# EAGLE board Gibbot v4.2 (EAGLE 5.12), part 1 of 3
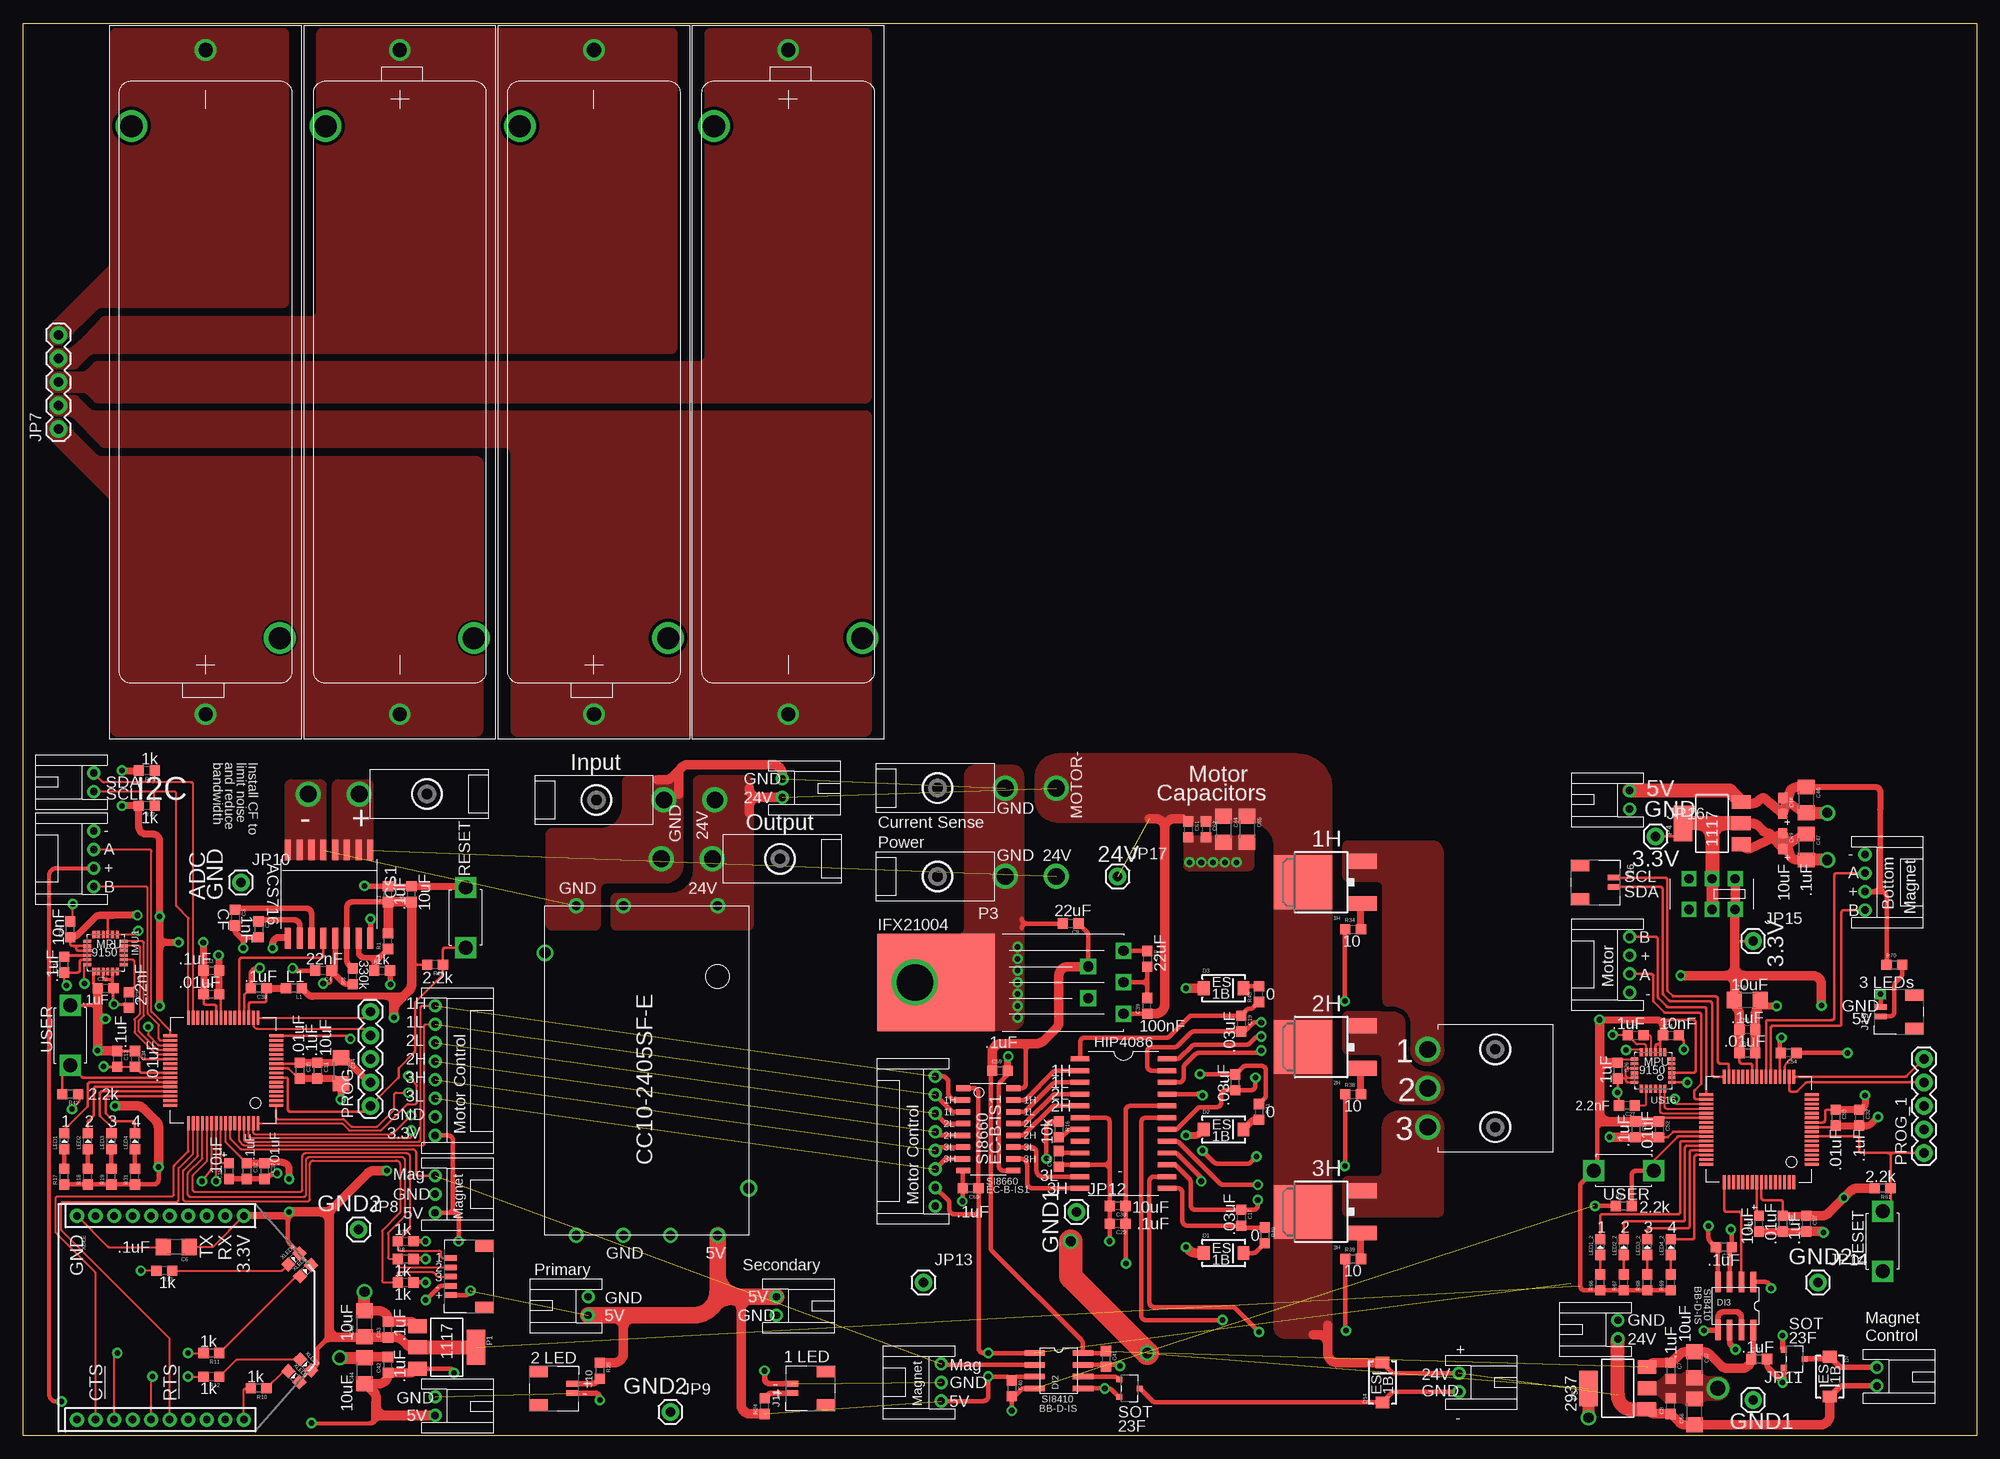
[diagram p7: board, top side]
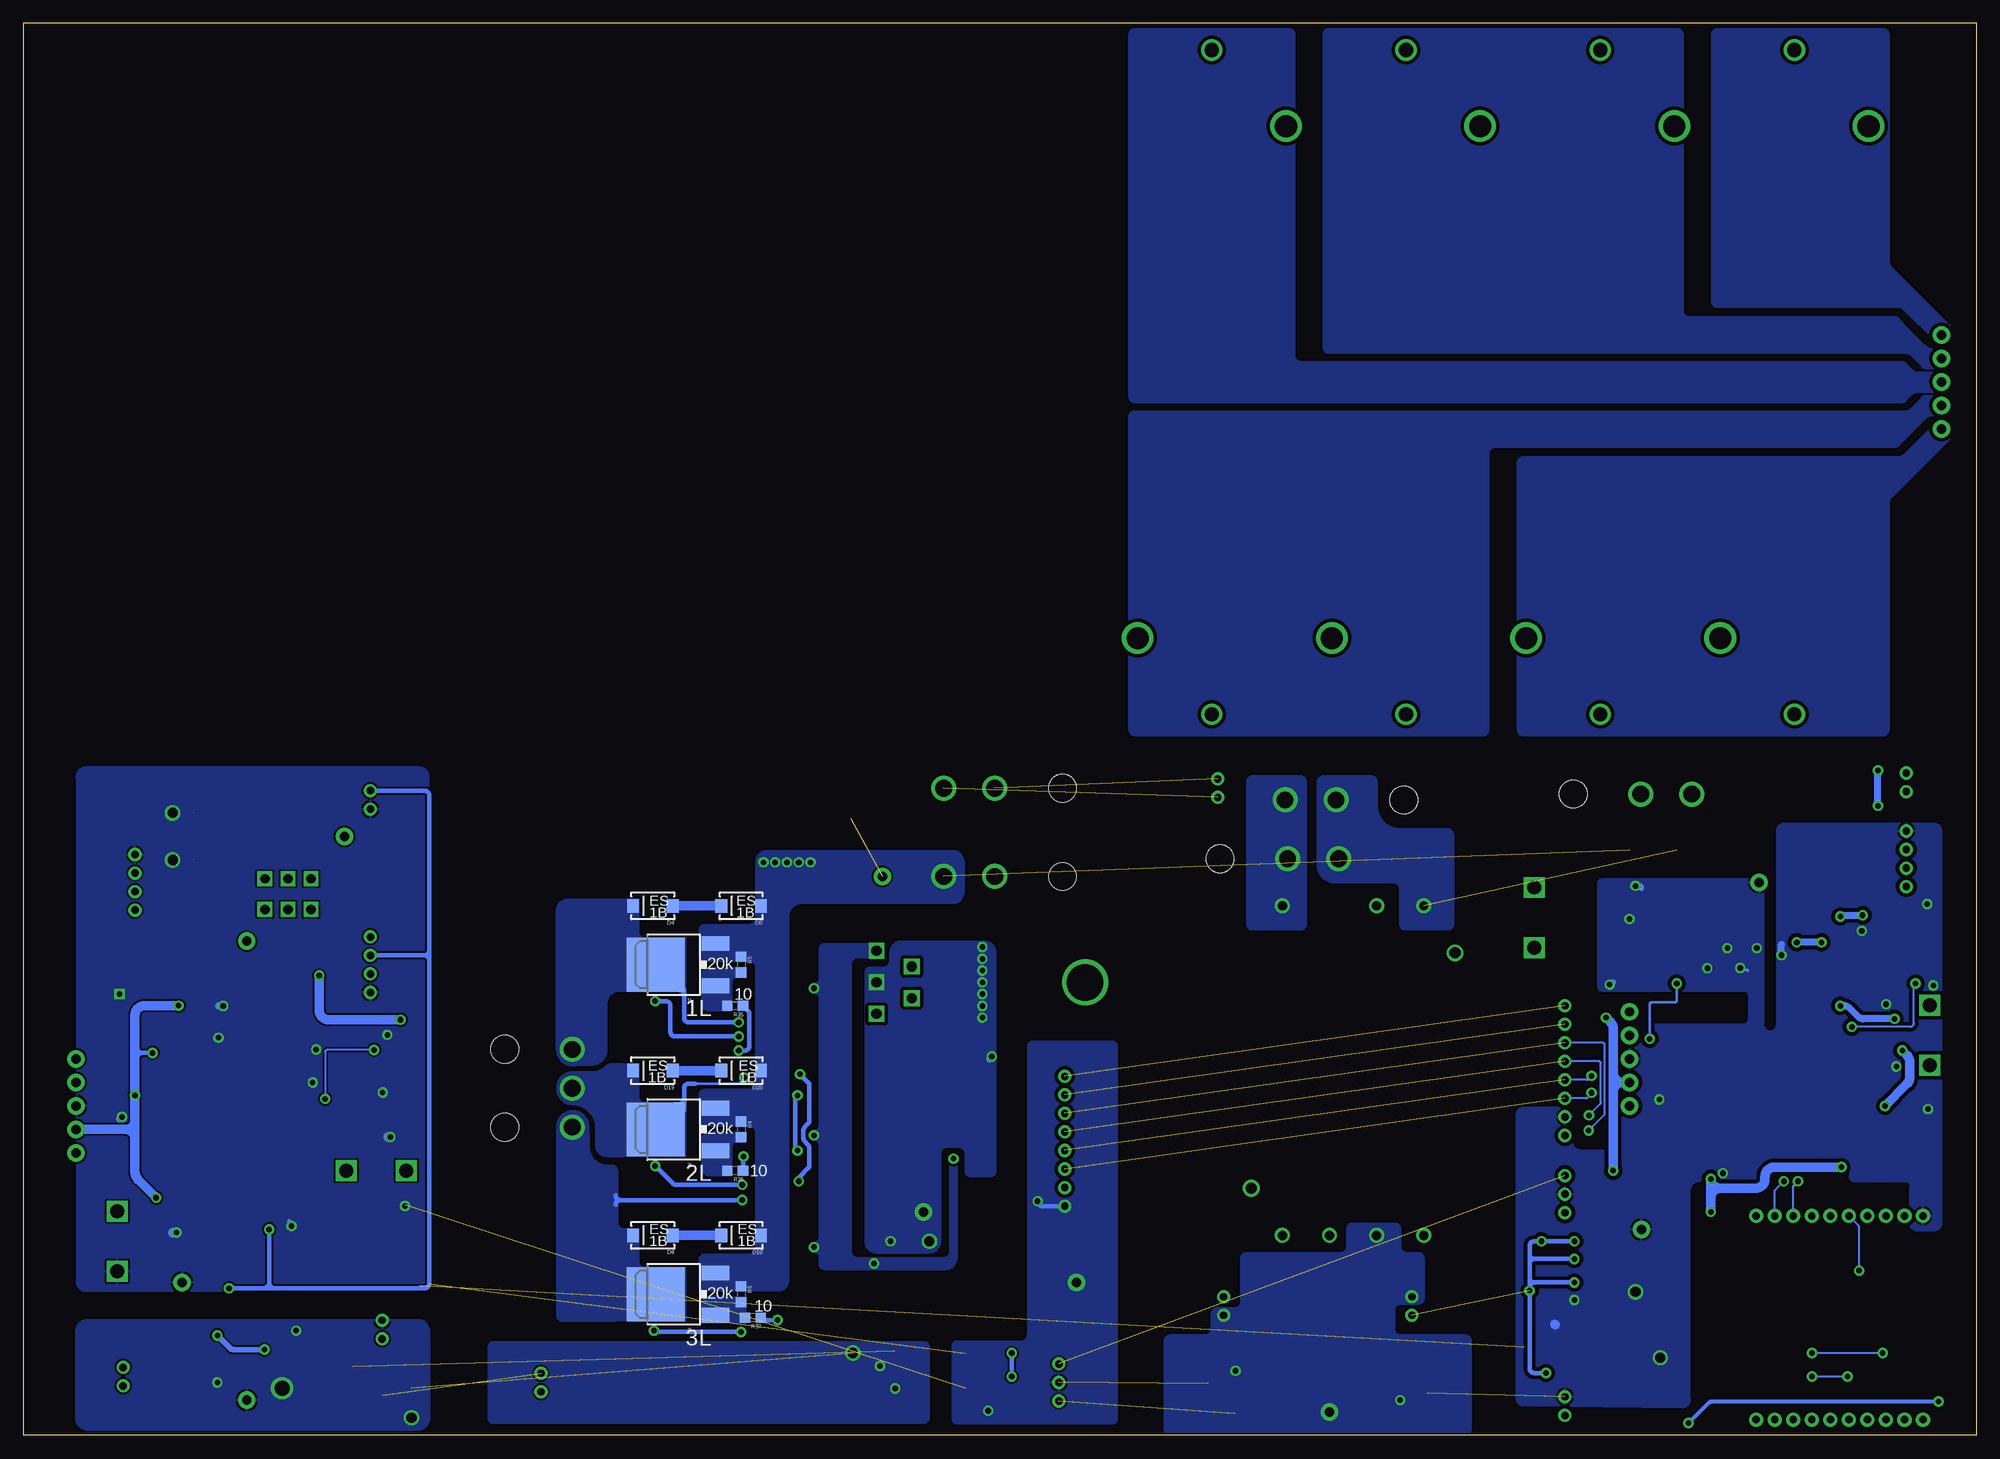
[diagram p8: board, bottom side, seen from below]

Size 210.82 x 152.4 mm. Coordinates in mm from the lower left corner, seen from the top.
Outline: 0,0 210.82,0 210.82,152.4 0,152.4 0,0
Copper layers (1*16): Top 0.035mm / dielectric 1.5mm / Bottom 0.035mm
Design rules "Andrew *": minimum track width 8mil, minimum drill 20mil, track to track 8mil, track to pad 8mil, pad to pad 2mil, via to via 8mil, smd to smd 8mil, copper to edge 10mil, drill to drill 8mil, minimum pad ring 12mil, minimum via ring 10mil, stop-mask expansion 4mil, vias tented up to drill 25mil, thermal gap 10mil

## Footprints (pad centres in the part's own frame; a part is rotated, then mirrored left to right if it is on the bottom)
DPAK = smd 5.791 x 6.274: D 0,1.587 | smd 1.6 x 3: G -2.286,-4.851; S 2.286,-4.851
1043P = drill 1.524 round: + -35.839,0; - 35.839,0 | drill 2.388 round: P$1 -27.622,-8.001; P$2 27.622,8.001
0603 = smd 1.1 x 1.1: 1 -0.85,0; 2 0.85,0
1206 = smd 1.6 x 1.8: 1 -1.4,0; 2 1.4,0
0603-POL = smd 1.1 x 1: + 0.85,0; - -0.85,0
SOIC16-W = smd 0.65 x 2.25: 1 -4.445,-4.75; 2 -3.175,-4.75; 3 -1.905,-4.75; 4 -0.635,-4.75; 5 0.635,-4.75; 6 1.905,-4.75; 7 3.175,-4.75; 8 4.445,-4.75; 9 4.445,4.75; 10 3.175,4.75; 11 1.905,4.75; 12 0.635,4.75; 13 -0.635,4.75; 14 -1.905,4.75; 15 -3.175,4.75; 16 -4.445,4.75
SMA-DIODE@1 = smd 1.27 x 1.47: A -2.15,0; C 2.15,0
SOIC16-N = smd 0.6 x 1.55: 1 -4.445,-2.7; 2 -3.175,-2.7; 3 -1.905,-2.7; 4 -0.635,-2.7; 5 0.635,-2.7; 6 1.905,-2.7; 7 3.175,-2.7; 8 4.445,-2.7; 9 4.445,2.7; 10 3.175,2.7; 11 1.905,2.7; 12 0.635,2.7; 13 -0.635,2.7; 14 -1.905,2.7; 15 -3.175,2.7; 16 -4.445,2.7
SOIC8-N = smd 2.2 x 0.6: 1 -2.6,1.905; 2 -2.6,0.635; 3 -2.6,-0.635; 4 -2.6,-1.905; 5 2.6,-1.905; 6 2.6,-0.635; 7 2.6,0.635; 8 2.6,1.905
LGA24_4X4 = smd 0.8 x 0.35: 1 -2,1.25; 2 -2,0.75; 3 -2,0.25; 4 -2,-0.25; 5 -2,-0.75; 6 -2,-1.25; 13 2,-1.25; 14 2,-0.75; 15 2,-0.25; 16 2,0.25; 17 2,0.75; 18 2,1.25 | smd 0.35 x 0.85: 7 -1.25,-1.975; 8 -0.75,-1.975; 9 -0.25,-1.975; 10 0.25,-1.975; 11 0.75,-1.975; 12 1.25,-1.975; 19 1.25,1.975; 20 0.75,1.975; 21 0.25,1.975; 22 -0.25,1.975; 23 -0.75,1.975; 24 -1.25,1.975
JST-2-PH-TH = drill 0.8 round: 1 -1,-6.35; 2 1,-6.35
JST-4-PH-TH = drill 0.8 round: 1 -3,-6.35; 2 -1,-6.35; 3 1,-6.35; 4 3,-6.35
JST-8-PH-TH = drill 0.8 round: 1 -7,-6.35; 2 -5,-6.35; 3 -3,-6.35; 4 -1,-6.35; 5 1,-6.35; 6 3,-6.35; 7 5,-6.35; 8 7,-6.35
JST-3-PH-TH = drill 0.8 round: 1 -2,-6.35; 2 0,-6.35; 3 2,-6.35
JST-SH-5 = smd 0.6 x 1.35: 1 2,4.675; 2 1,4.675; 3 0,4.675; 4 -1,4.675; 5 -2,4.675 | smd 1.2 x 2: P$6 -3.3,1; P$7 3.3,1
JST-SH-2 = smd 0.6 x 1.35: 1 0.5,4.675; 2 -0.5,4.675 | smd 1.2 x 2: P$6 -1.8,1; P$7 1.8,1
MOLEX-2-MINIFITJR-RA = drill 1.803 round: 1 0,13.894; 2 0,19.406 | hole 3: 0,6.604
MOLEX-3-MINIFITJR-RA = drill 1.803 round: 1 4.191,13.538; 2 0,13.538; 3 -4.191,13.538 | hole 3: -4.204,6.248; 4.204,6.248
1X05 = drill 1.016 pad 1.88 round: 1 0,0; 2 2.54,0; 3 5.08,0; 4 7.62,0; 5 10.16,0
1X01 = drill 1.016 pad 1.88 round: 1 0,0
0603-DIODE = smd 1.1 x 1.1: AN -0.85,0; CAT 0.85,0
SOT23F = smd 0.6 x 0.65: D 0,1.125; G -0.95,-1.125; S 0.95,-1.125
SOIC24-W = smd 0.533 x 1.981: 1 -6.985,-4.686; 2 -5.715,-4.686; 3 -4.445,-4.686; 4 -3.175,-4.686; 5 -1.905,-4.686; 6 -0.635,-4.686; 7 0.635,-4.686; 8 1.905,-4.686; 9 3.175,-4.686; 10 4.445,-4.686; 11 5.715,-4.686; 12 6.985,-4.686; 13 6.985,4.686; 14 5.715,4.686; 15 4.445,4.686; 16 3.175,4.686; 17 1.905,4.686; 18 0.635,4.686; 19 -0.635,4.686; 20 -1.905,4.686; 21 -3.175,4.686; 22 -4.445,4.686; 23 -5.715,4.686; 24 -6.985,4.686
SOT223 = smd 1.499 x 2.007: 1 -2.261,-3.15; 2 0.025,-3.15; 3 2.311,-3.15 | smd 3.81 x 2.007: 4 0,3.15
CC10-2405SF-E = drill 1 round: 1 -17.78,7.62; 2 -17.78,-2.54; 3 -17.78,-7.62; 4 17.78,-7.62; 5 17.78,-2.54; 6 17.78,2.54; 7 17.78,7.62 | drill 1.2 round: P$1 12.7,11; P$2 -12.7,-11
TO220-5 = drill 1.1 square: 1 3.81,-3.404; 2 0,-1.702; 3 3.81,0; 4 0,1.702; 5 3.81,3.404 | smd 12.7 x 10.541: PAD -16.434,0 | drill 3.937 round: PAD2 -18.72,0
TQFP64_10X10 = smd 1.5 x 0.3: 1 -5.7,3.75; 2 -5.7,3.25; 3 -5.7,2.75; 4 -5.7,2.25; 5 -5.7,1.75; 6 -5.7,1.25; 7 -5.7,0.75; 8 -5.7,0.25; 9 -5.7,-0.25; 10 -5.7,-0.75; 11 -5.7,-1.25; 12 -5.7,-1.75; 13 -5.7,-2.25; 14 -5.7,-2.75; 15 -5.7,-3.25; 16 -5.7,-3.75; 33 5.7,-3.75; 34 5.7,-3.25; 35 5.7,-2.75; 36 5.7,-2.25; 37 5.7,-1.75; 38 5.7,-1.25; 39 5.7,-0.75; 40 5.7,-0.25; 41 5.7,0.25; 42 5.7,0.75; 43 5.7,1.25; 44 5.7,1.75; 45 5.7,2.25; 46 5.7,2.75; 47 5.7,3.25; 48 5.7,3.75 | smd 0.3 x 1.5: 17 -3.75,-5.7; 18 -3.25,-5.7; 19 -2.75,-5.7; 20 -2.25,-5.7; 21 -1.75,-5.7; 22 -1.25,-5.7; 23 -0.75,-5.7; 24 -0.25,-5.7; 25 0.25,-5.7; 26 0.75,-5.7; 27 1.25,-5.7; 28 1.75,-5.7; 29 2.25,-5.7; 30 2.75,-5.7; 31 3.25,-5.7; 32 3.75,-5.7; 49 3.75,5.7; 50 3.25,5.7; 51 2.75,5.7; 52 2.25,5.7; 53 1.75,5.7; 54 1.25,5.7; 55 0.75,5.7; 56 0.25,5.7; 57 -0.25,5.7; 58 -0.75,5.7; 59 -1.25,5.7; 60 -1.75,5.7; 61 -2.25,5.7; 62 -2.75,5.7; 63 -3.25,5.7; 64 -3.75,5.7
TACTILE_SWITCH = drill 1.5 square: 1 -3.25,0; 2 3.25,0
SLIDE_SWITCH = drill 1 square: 1 -2.489,1.651; 2 0,1.651; 3 2.489,1.651; 4 2.489,-1.651; 5 0,-1.651; 6 -2.489,-1.651
XBEE-SILK = drill 0.8 pad 1.524 round: 1 -11,20; 2 -11,18; 3 -11,16; 4 -11,14; 5 -11,12; 6 -11,10; 7 -11,8; 8 -11,6; 9 -11,4; 10 -11,2; 11 11,2; 12 11,4; 13 11,6; 14 11,8; 15 11,10; 16 11,12; 17 11,14; 18 11,16; 19 11,18; 20 11,20

## Placement (x,y rotation side)
1H  IRLR024  [DPAK]  139.7,59.69 90 top
1L  IRLR024  [DPAK]  140.97,50.8 90 bottom
2H  IRLR024  [DPAK]  139.7,41.91 90 top
2L  IRLR024  [DPAK]  140.97,33.02 90 bottom
3H  IRLR024  [DPAK]  139.7,24.13 90 top
3L  IRLR024  [DPAK]  140.97,15.24 90 bottom
BAT1  BATTERY-18650HOLDER  [1043P]  19.68,113.67 90 top
BAT2  BATTERY-18650HOLDER  [1043P]  40.64,113.67 270 top
BAT3  BATTERY-18650HOLDER  [1043P]  61.59,113.67 90 top
BAT4  BATTERY-18650HOLDER  [1043P]  82.55,113.67 270 top
C1  .1uF  [0603]  39.37,58.42 90 top
C2  1nF  [0603]  25.4,54.61 270 top
C3  DNI  [0603]  22.86,55.88 270 top
C4  22nF  [0603]  32.38,50.16 180 top
C5  10uF  [0603]  41.91,58.42 90 top
C6  .1uF  [1206]  16.51,20.32 180 top
C7  .1uF  [0603]  177.8,6.99 270 top
C8  .1uF  [0603]  177.8,3.17 90 top
C9  22uF  [0603]  113.03,55.24 180 top
C10  22uF  [0603]  121.28,51.44 270 top
C11  .1uF  [0603]  31.75,39.37 270 top
C12  .1uF  [0603]  24.13,28.52 270 top
C13  .1uF  [0603]  10.16,40.64 270 top
C14  10uF  [1206]  34.29,39.37 270 top
C15  10uF  [0603-POL]  22.23,28.52 90 top
C16  DNI  [0603]  111.76,29.84 90 top
C17  .03uF  [0603]  131.44,23.5 270 top
C18  .03uF  [0603]  130.81,38.1 90 top
C19  .03uF  [0603]  131.44,44.45 270 top
C20  10nF  [0603]  5.08,54.61 90 top
C21  .1uF  [0603]  4.45,50.8 90 top
C22  .1uF  [0603]  8.89,48.26 0 top
C23  2.2nF  [0603]  11.43,46.99 270 top
C24  10nF  [0603]  177.8,43.18 0 top
C25  .1uF  [0603]  173.99,43.18 0 top
C26  .1uF  [0603]  172.09,39.37 270 top
C27  2.2nF  [0603]  173.05,35.61 180 top
C28  .1uF  [0603]  183.51,20.32 180 top
C29  .1uF  [0603]  118.11,22.86 180 top
C30  10uF  [0603]  118.11,24.77 180 top
C31  .1uF  [0603]  187.32,8.26 0 top
C32  .1uF  [0603]  198.12,34.29 270 top
C33  .1uF  [0603]  20.32,50.16 0 top
C34  .01uF  [0603]  12.06,40.64 270 top
C35  .01uF  [0603]  29.84,39.37 270 top
C36  .01uF  [0603]  20.32,47.62 0 top
C37  .01uF  [0603]  26.04,28.52 270 top
C38  .1uF  [0603]  25.4,48.26 180 top
C39  100nF  [0603]  121.28,46.35 90 top
C40  .1uF  [0603]  106.68,5.08 270 top
C41  .1uF  [0603]  116.84,8.26 270 top
C42  .1uF  [0603]  39.37,7.62 90 top
C43  .1uF  [0603]  39.37,11.43 90 top
C44  10uF  [1206]  36.83,6.99 90 top
C45  10uF  [1206]  36.83,12.06 90 top
C46  .1uF  [1206]  192.41,68.58 270 top
C47  .1uF  [1206]  192.41,63.5 270 top
C48  10uF  [0603-POL]  189.87,67.94 270 top
C49  10uF  [0603-POL]  189.87,64.14 270 top
C50  .01uF  [0603]  189.87,22.86 270 top
C51  .01uF  [0603]  186.06,41.27 0 top
C52  .01uF  [0603]  176.53,33.02 270 top
C53  .01uF  [0603]  195.58,34.29 270 top
C54  .1uF  [0603]  190.5,41.27 180 top
C55  .1uF  [0603]  173.99,33.02 270 top
C56  .1uF  [0603]  186.06,43.81 0 top
C57  .1uF  [0603]  192.41,22.86 270 top
C58  10uF  [1206]  186.06,46.99 0 top
C59  .1uF  [0603]  105.41,39.37 0 top
C60  .1uF  [0603]  102.23,26.67 180 top
C61  .01uF  [0603]  125.73,65.41 270 top
C62  .1uF  [0603]  127.64,65.41 270 top
C63  10uF  [0603-POL]  187.32,22.86 90 top
C64  1uF  [1206]  129.54,65.41 270 top
C65  10uF  [1206]  132.08,65.41 270 top
C66  10uF  [1206]  180.34,2.54 90 top
C67  10uF  [1206]  180.34,7.62 270 top
CS1  ACS716KLATR-6BB-T  [SOIC16-W]  33.02,58.42 180 top
D1  ES1B  [SMA-DIODE@1]  129.54,19.68 0 top
D2  ES1B  [SMA-DIODE@1]  129.54,33.02 0 top
D3  ES1B  [SMA-DIODE@1]  129.54,48.26 0 top
D4  ES1B  [SMA-DIODE@1]  142.88,57.15 180 bottom
D5  ES1B  [SMA-DIODE@1]  133.35,57.15 180 bottom
D7  ES1B  [SMA-DIODE@1]  194.94,6.35 270 top
D9  ES1B  [SMA-DIODE@1]  142.88,21.59 180 bottom
D10  ES1B  [SMA-DIODE@1]  133.35,21.59 180 bottom
D14  ES1B  [SMA-DIODE@1]  146.69,5.71 90 top
D19  ES1B  [SMA-DIODE@1]  142.88,39.37 180 bottom
D20  ES1B  [SMA-DIODE@1]  133.35,39.37 180 bottom
DI1  DIGITAL-ISOLATOR-6CH  [SOIC16-N]  104.14,33.02 270 top
DI2  DIGITAL-ISOLATOR-1CHSOIC8-N  [SOIC8-N]  111.76,6.99 0 top
DI3  DIGITAL-ISOLATOR-1CHSOIC8-N  [SOIC8-N]  184.78,13.97 270 top
IMU1  MPU-9150  [LGA24_4X4]  8.89,52.07 270 top
J1  [JST-2-PH-TH]  1.27,70.48 90 top
J2  [JST-4-PH-TH]  1.27,62.23 90 top
J3  MO8JST-SH-TH  [JST-8-PH-TH]  50.8,39.37 270 top
J4  [JST-3-PH-TH]  50.8,26.04 270 top
J5  [JST-SH-5]  50.8,17.14 90 top
J6  [JST-2-PH-TH]  50.8,3.17 270 top
J7  [JST-2-PH-TH]  88.27,69.85 270 top
J8  [JST-2-PH-TH]  54.61,13.97 90 top
J9  [JST-2-PH-TH]  87.63,13.97 270 top
J10  [JST-SH-2]  54.61,5.08 270 top
J11  [JST-SH-2]  87.63,5.08 90 top
J12  MO8JST-SH-TH  [JST-8-PH-TH]  92.08,31.75 90 top
J13  [JST-3-PH-TH]  92.71,5.71 90 top
J14  [JST-2-PH-TH]  161.29,5.71 270 top
J15  [JST-2-PH-TH]  167,68.58 90 top
J16  [JST-SH-2]  167,59.69 270 top
J17  [JST-4-PH-TH]  205.1,59.69 270 top
J18  [JST-4-PH-TH]  167,50.8 90 top
J19  [JST-SH-2]  205.1,45.72 90 top
J20  [JST-2-PH-TH]  165.74,11.43 90 top
J21  [JST-2-PH-TH]  206.38,6.35 270 top
JP1  [MOLEX-2-MINIFITJR-RA]  50.16,69.22 90 top
JP2  [MOLEX-2-MINIFITJR-RA]  55.24,68.58 270 top
JP3  [MOLEX-2-MINIFITJR-RA]  88.27,62.23 90 top
JP4  [MOLEX-2-MINIFITJR-RA]  92.08,69.85 270 top
JP5  [MOLEX-2-MINIFITJR-RA]  92.08,60.33 270 top
JP6  [MOLEX-3-MINIFITJR-RA]  165.1,37.47 90 top
JP7  [1X05]  3.81,108.58 90 top
JP8  M01PTH  [1X01]  36.2,22.23 0 top
JP9  M01PTH  [1X01]  69.85,2.54 0 top
JP10  M01PTH  [1X01]  23.5,59.69 0 top
JP11  M01PTH  [1X01]  186.69,3.81 0 top
JP12  M01PTH  [1X01]  113.67,24.13 0 top
JP13  M01PTH  [1X01]  97.16,16.51 0 top
JP14  M01PTH  [1X01]  193.68,16.51 0 top
JP15  M01PTH  [1X01]  186.69,53.34 0 top
JP16  M01PTH  [1X01]  176.15,64.64 0 top
JP17  M01PTH  [1X01]  118.11,60.33 0 top
L1  0ohm  [0603]  29.21,48.26 180 top
LED1  [0603-DIODE]  4.45,31.75 90 top
LED1_2  [0603-DIODE]  170.18,20.32 90 top
LED2  [0603-DIODE]  6.99,31.75 90 top
LED2_2  [0603-DIODE]  172.72,20.32 90 top
LED3  [0603-DIODE]  9.53,31.75 90 top
LED3_2  [0603-DIODE]  175.26,20.32 90 top
LED4  [0603-DIODE]  12.06,31.75 90 top
LED4_2  [0603-DIODE]  177.8,20.32 90 top
M1  N-MOSSOT23F  [SOT23F]  119.38,5.08 270 top
M2  N-MOSSOT23F  [SOT23F]  191.13,8.26 270 top
MD1  HIP4086  [SOIC24-W]  118.75,33.66 270 top
P1  LINEAR-REGREG1117  [SOT223]  45.72,9.53 270 top
P2  CC10-2405SF-E  [CC10-2405SF-E]  67.31,39.37 270 top
P3  IFX21004TNV51  [TO220-5]  114.94,48.9 0 top
P4  LINEAR-REGREG1117  [SOT223]  182.25,66.04 90 top
P5  LINEAR-REGLM2937  [SOT223]  172.09,5.08 90 top
PIC1  DSPIC33EP512MC806  [TQFP64_10X10]  21.59,39.37 180 top
PIC2  DSPIC33EP512MC806  [TQFP64_10X10]  187.32,33.02 180 top
PROG  [1X05]  37.47,35.56 90 top
PROG_1  [1X05]  205.1,30.48 90 top
R1  2k  [0603]  39.37,53.34 90 top
R2  1k  [0603]  38.73,50.16 0 top
R3  330k  [0603]  35.56,49.53 90 top
R4  20k  [0603]  133.35,33.02 270 bottom
R5  20k  [0603]  133.35,50.8 270 bottom
R6  20k  [0603]  133.35,15.24 270 bottom
R7  1k  [0603]  41.27,20.95 0 top
R8  1k  [0603]  41.27,19.05 0 top
R9  1k  [0603]  41.27,16.51 0 top
R10  1k  [0603]  25.4,5.08 180 top
R11  1k  [0603]  20.32,8.89 180 top
R12  1k  [0603]  20.32,6.35 180 top
R13  1k  [0603]  15.24,17.78 180 top
R14  2.2k  [0603]  44.45,50.8 180 top
R16  10k  [0603]  111.76,33.02 270 top
R17  1k  [0603]  4.45,27.94 90 top
R18  1k  [0603]  6.99,27.94 90 top
R19  1k  [0603]  9.53,27.94 90 top
R24  47  [0603]  80.01,3.17 90 top
R25  22  [0603]  62.23,6.99 270 top
R31  1k  [0603]  12.06,27.94 90 top
R34  10ohm  [0603]  143.51,54.61 0 top
R35  10ohm  [0603]  133.99,46.35 180 bottom
R36  10ohm  [0603]  133.99,28.57 180 bottom
R37  10ohm  [0603]  132.08,12.7 180 bottom
R38  10ohm  [0603]  143.51,36.83 0 top
R39  10ohm  [0603]  143.51,19.05 0 top
R40  0ohm  [0603]  133.99,21.59 270 top
R41  0ohm  [0603]  133.35,34.92 270 top
R42  2.2k  [0603]  5.08,36.83 180 top
R43  0ohm  [0603]  133.35,47.62 90 top
R61  2.2k  [0603]  200.66,26.67 180 top
R66  1k  [0603]  170.18,16.51 90 top
R67  1k  [0603]  172.72,16.51 90 top
R68  1k  [0603]  175.26,16.51 90 top
R69  1k  [0603]  177.8,16.51 90 top
R70  3.3  [0603]  201.93,50.8 0 top
R73  2.2k  [0603]  172.72,24.77 0 top
R77  1k  [0603]  13.34,67.94 180 top
R78  1k  [0603]  13.34,71.75 180 top
RESET1  TACTILE_SWITCH  [TACTILE_SWITCH]  47.75,55.88 90 top
RESET2  TACTILE_SWITCH  [TACTILE_SWITCH]  200.66,20.95 270 top
U$16  MPU-9150  [LGA24_4X4]  175.9,39.37 180 top
U$73  SLIDE_SWTHROUGHHOLE  [SLIDE_SWITCH]  182.25,58.42 180 top
USER1  TACTILE_SWITCH  [TACTILE_SWITCH]  5.08,43.18 270 top
USER_2  TACTILE_SWITCH  [TACTILE_SWITCH]  172.72,28.57 0 top
XBEE  XBEE-1B2  [XBEE-SILK]  3.81,12.7 270 top
XLED1  [0603-DIODE]  29.21,6.35 315 top
XLED2  [0603-DIODE]  30.48,17.78 45 top
XLED3  [0603-DIODE]  30.48,7.62 315 top
XLED4  [0603-DIODE]  29.21,19.05 45 top